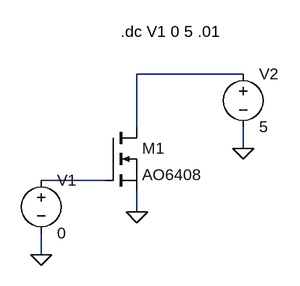
[diagram p0: schematic Draft1.asc]
Draft1.asc, the LTspice schematic file:
Version 4.1
SHEET 1 880 680
WIRE 304 16 144 16
WIRE 144 96 144 16
WIRE 304 128 304 96
WIRE 96 176 0 176
WIRE 144 224 144 192
WIRE 0 288 0 256
FLAG 144 224 0
FLAG 0 288 0
FLAG 304 128 0
SYMBOL nmos 96 96 R0
SYMATTR InstName M1
SYMATTR Value AO6408
SYMBOL voltage 0 160 R0
WINDOW 123 0 0 Left 0
WINDOW 39 0 0 Left 0
SYMATTR InstName V1
SYMATTR Value 0
SYMBOL voltage 304 0 R0
WINDOW 123 0 0 Left 0
WINDOW 39 0 0 Left 0
SYMATTR InstName V2
SYMATTR Value 5
TEXT 120 -48 Left 2 !.dc V1 0 5 .01

The netlist it stands for:
* Draft1.asc
M1 N001 N002 0 0 AO6408
V1 N002 0 0
V2 N001 0 5
.model NMOS NMOS
.model PMOS PMOS
.lib standard.mos
.dc V1 0 5 .01
.backanno
.end